# EAGLE design TEC-Controller (EAGLE 7.5.0)
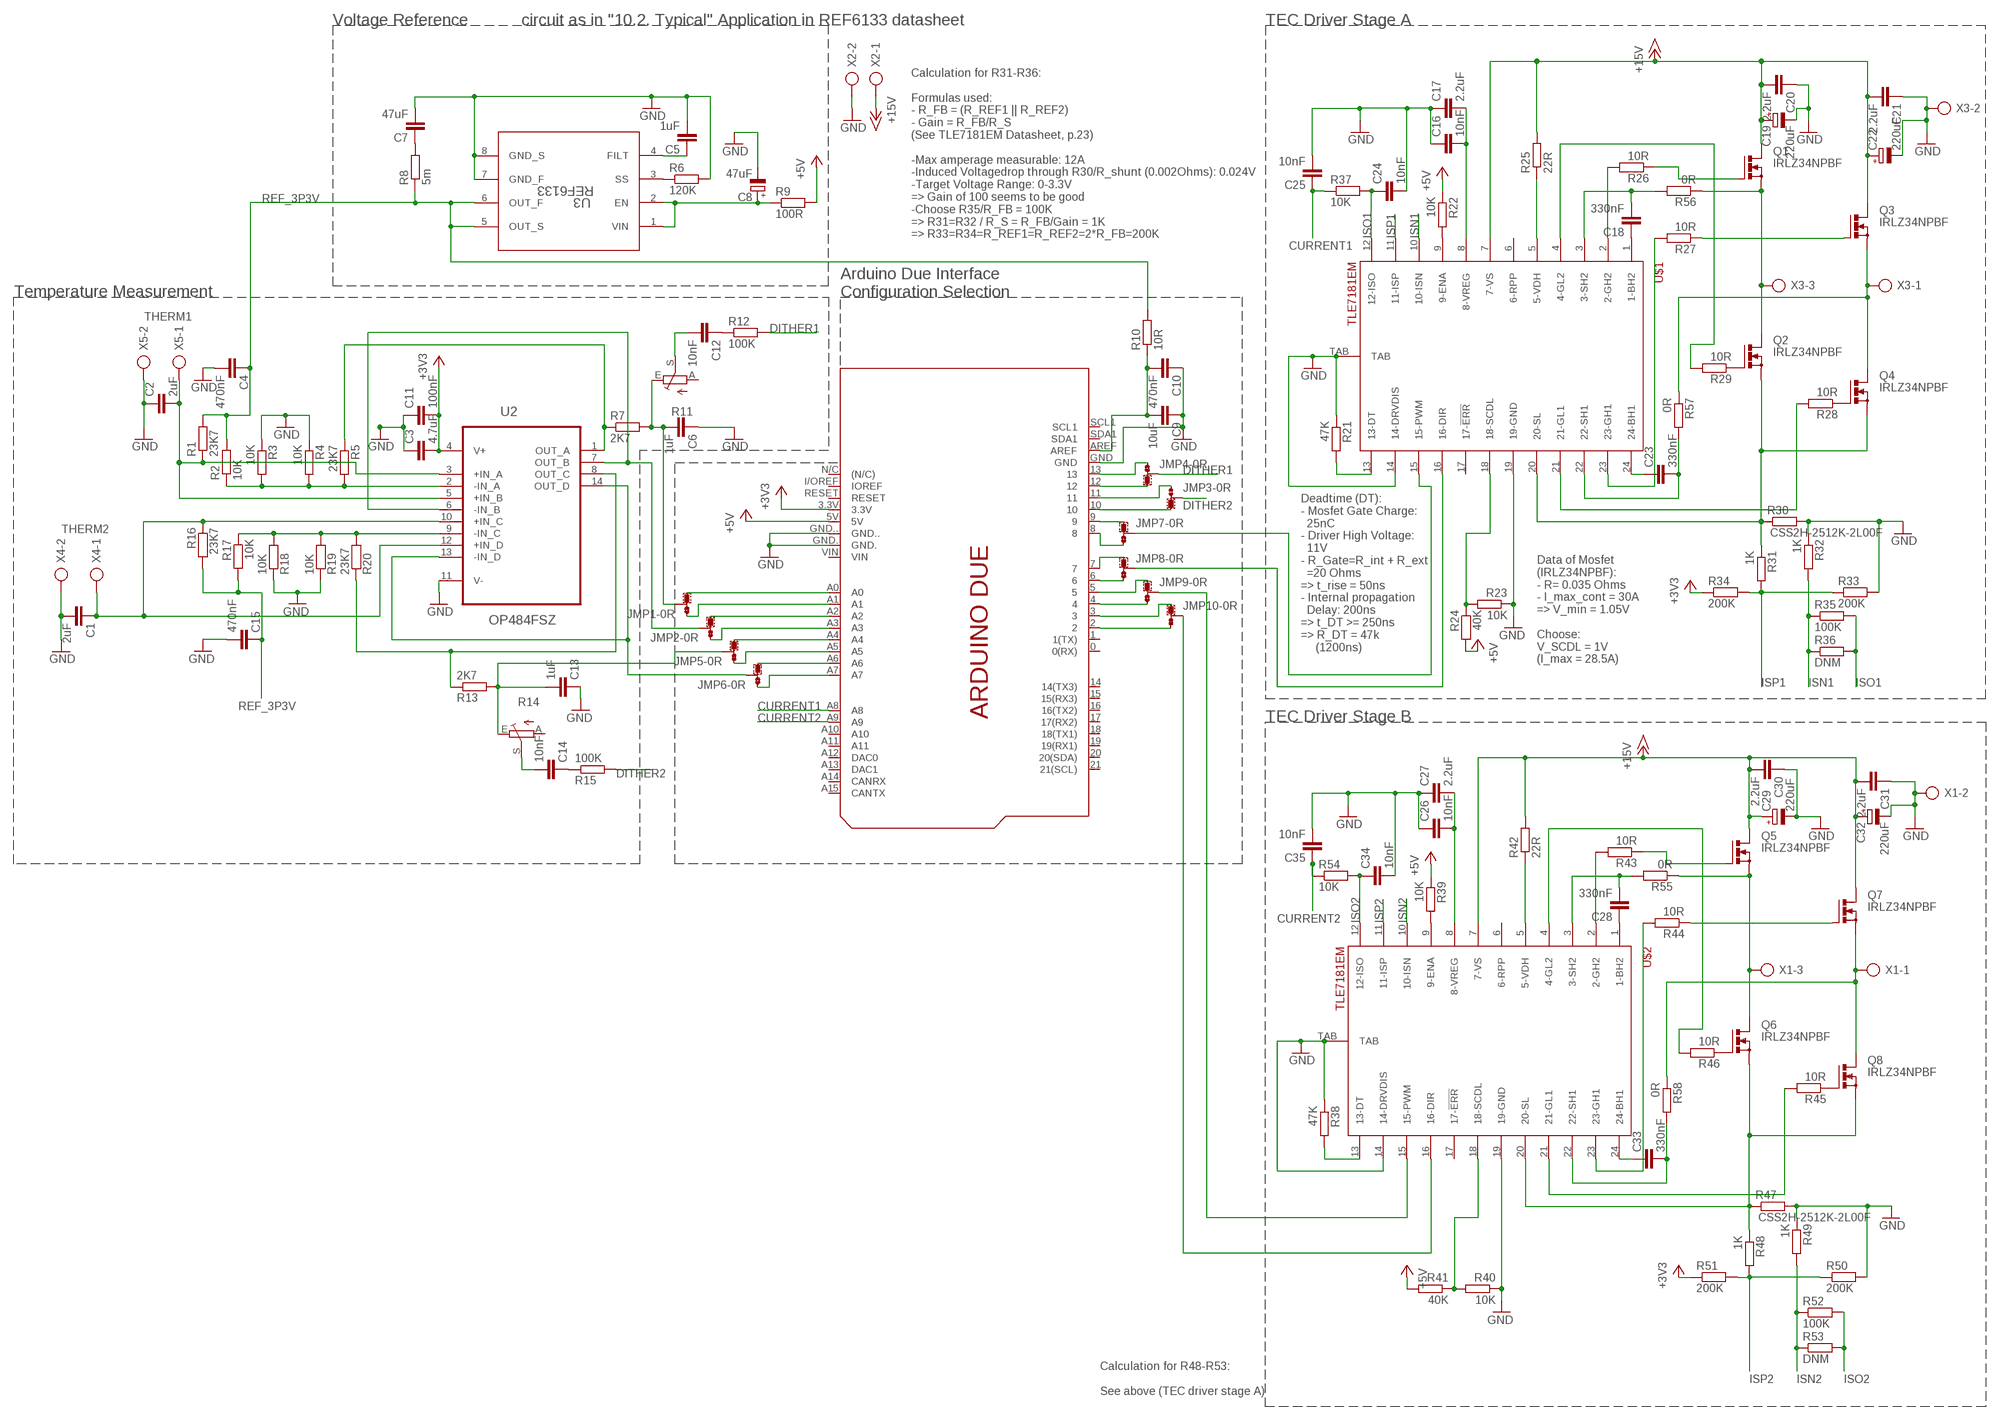
[diagram p0: schematic, sheet 1]

## Parts
C1  2uF  C-EUC0805  [C0805]
C2  2uF  C-EUC0805  [C0805]
C3  4.7uF  C-EUC0603  [C0603]
C4  470nF  C-EUC0805  [C0805]
C5  1uF  C-EUC0805  [C0805]
C6  1uF  C-EUC0805  [C0805]
C7  47uF  C-EUC0603  [C0603]
C8  47uF  CPOL-EUD  [PANASONIC_D]
C9  10uF  C-EUC0603  [C0603]
C10  470nF  C-EUC0603  [C0603]
C11  100nF  C-EUC0603  [C0603]
C12  10nF  C-EUC0805  [C0805]
C13  1uF  C-EUC0805  [C0805]
C14  10nF  C-EUC0805  [C0805]
C15  470nF  C-EUC0603  [C0603]
C16  10nF  C-EUC0603K  [C0603K]
C17  2.2uF  C-EUC0603K  [C0603K]
C18  330nF  C-EUC0603K  [C0603K]
C19  220uF  CPOL-EUE2.5-7  [E2,5-7]
C20  2.2uF  C-EUC0603K  [C0603K]
C21  2.2uF  C-EUC0603K  [C0603K]
C22  220uF  CPOL-EUE2.5-7  [E2,5-7]
C23  330nF  C-EUC0603K  [C0603K]
C24  10nF  C-EUC0603K  [C0603K]
C25  10nF  C-EUC0603K  [C0603K]
C26  10nF  C-EUC0603  [C0603]
C27  2.2uF  C-EUC0603  [C0603]
C28  330nF  C-EUC0603K  [C0603K]
C29  220uF  CPOL-EUE2.5-7  [E2,5-7]
C30  2.2uF  C-EUC0603K  [C0603K]
C31  2.2uF  C-EUC0603K  [C0603K]
C32  220uF  CPOL-EUE2.5-7  [E2,5-7]
C33  330nF  C-EUC0603K  [C0603K]
C34  10nF  C-EUC0603  [C0603]
C35  10nF  C-EUC0603  [C0603]
JMP1  0R-JUMPA  [A0R-JMP]
JMP2  0R-JUMPA  [A0R-JMP]
JMP3  0R-JUMPA  [A0R-JMP]
JMP4  0R-JUMPA  [A0R-JMP]
JMP5  0R-JUMPA  [A0R-JMP]
JMP6  0R-JUMPA  [A0R-JMP]
JMP7  0R-JUMPA  [A0R-JMP]
JMP8  0R-JUMPA  [A0R-JMP]
JMP9  0R-JUMPA  [A0R-JMP]
JMP10  0R-JUMPA  [A0R-JMP]
PCB1  ARDUINO_DUE_SHIELD  [ARDUINO_DUE_SHIELD]
Q1  IRLZ34NPBF  PMOSFET_NTO220BV  [TO220BV]
Q2  IRLZ34NPBF  PMOSFET_NTO220BV  [TO220BV]
Q3  IRLZ34NPBF  PMOSFET_NTO220BV  [TO220BV]
Q4  IRLZ34NPBF  PMOSFET_NTO220BV  [TO220BV]
Q5  IRLZ34NPBF  PMOSFET_NTO220BV  [TO220BV]
Q6  IRLZ34NPBF  PMOSFET_NTO220BV  [TO220BV]
Q7  IRLZ34NPBF  PMOSFET_NTO220BV  [TO220BV]
Q8  IRLZ34NPBF  PMOSFET_NTO220BV  [TO220BV]
R1  23K7  R-EU_R0603  [R0603]
R2  10K  R-EU_R0603  [R0603]
R3  10K  R-EU_R0603  [R0603]
R4  10K  R-EU_R0805  [R0805]
R5  23K7  R-EU_R0805  [R0805]
R6  120K  R-EU_R0805  [R0805]
R7  2K7  R-EU_R0805  [R0805]
R8  5m  R-EU_R0603  [R0603]
R9  100R  R-EU_R0805  [R0805]
R10  10R  R-EU_R0805  [R0805]
R11  TRIM_EU-B64W  [B64W]
R12  100K  R-EU_R0805  [R0805]
R13  2K7  R-EU_R0805  [R0805]
R14  TRIM_EU-B64W  [B64W]
R15  100K  R-EU_R0805  [R0805]
R16  23K7  R-EU_R0805  [R0805]
R17  10K  R-EU_R0805  [R0805]
R18  10K  R-EU_R0805  [R0805]
R19  10K  R-EU_R0805  [R0805]
R20  23K7  R-EU_R0805  [R0805]
R21  47K  R-EU_R0603  [R0603]
R22  10K  R-EU_R0603  [R0603]
R23  10K  R-EU_R0603  [R0603]
R24  40K  R-EU_R0603  [R0603]
R25  22R  R-EU_R0603  [R0603]
R26  10R  R-EU_R0805  [R0805]
R27  10R  R-EU_0204/7  [0204/7]
R28  10R  R-EU_0204/7  [0204/7]
R29  10R  R-EU_0204/7  [0204/7]
R30  CSS2H-2512K-2L00F  R-EU_R2512  [R2512]
R31  1K  R-EU_R0603  [R0603]
R32  1K  R-EU_R0603  [R0603]
R33  200K  R-EU_R0603  [R0603]
R34  200K  R-EU_R0603  [R0603]
R35  100K  R-EU_R0603  [R0603]
R36  DNM  R-EU_R0603  [R0603]
R37  10K  R-EU_R0603  [R0603]
R38  47K  R-EU_R0603  [R0603]
R39  10K  R-EU_R0603  [R0603]
R40  10K  R-EU_R0603  [R0603]
R41  40K  R-EU_R0603  [R0603]
R42  22R  R-EU_R0603  [R0603]
R43  10R  R-EU_0204/7  [0204/7]
R44  10R  R-EU_0204/7  [0204/7]
R45  10R  R-EU_0204/7  [0204/7]
R46  10R  R-EU_0204/7  [0204/7]
R47  CSS2H-2512K-2L00F  R-EU_R2512  [R2512]
R48  1K  R-EU_R0603  [R0603]
R49  1K  R-EU_R0603  [R0603]
R50  200K  R-EU_R0603  [R0603]
R51  200K  R-EU_R0603  [R0603]
R52  100K  R-EU_R0603  [R0603]
R53  DNM  R-EU_R0603  [R0603]
R54  10K  R-EU_R0603  [R0603]
R55  0R  R-EU_0204/7  [0204/7]
R56  0R  R-EU_0204/7  [0204/7]
R57  0R  R-EU_0204/7  [0204/7]
R58  0R  R-EU_0204/7  [0204/7]
U2  OP484FSZ  [SOIC127P600X175-14N]
U3  REF6133  REF6033IDGKR  [DGK0008A_N]
U$1  TLE7181EM  [PG-SSOP-24-4]
U$2  TLE7181EM  [PG-SSOP-24-4]
X1  AK500/3  [AK500/3]
X2  AK500/2  [AK500/2]
X3  AK500/3  [AK500/3]
X4  AK500/2  [AK500/2]
X5  AK500/2  [AK500/2]

## Nets
+3V3: C3.2 C11.2 PCB1.3.3V R34.1 R51.1 U2.4(V+)
+5V: PCB1.5V R9.2 R22.1 R24.2 R39.1 R41.2
+15V: C19.+ C20.2 C21.2 C22.+ C29.+ C30.2 C31.2 C32.+ Q1.D Q3.D Q5.D Q7.D R25.2 R42.2 U$1.7(7-VS) U$2.7(7-VS) X2.1
CURRENT1: C25.1 PCB1.A8 R37.1
CURRENT2: C35.1 PCB1.A9 R54.1
DITHER1: JMP4.2 R12.2
DITHER2: JMP3.2 R15.2
GND: C1.2 C2.1 C3.1 C4.2 C5.2 C6.1 C7.2 C8.- C9.1 C10.1 C11.1 C13.1 C15.2 C16.1 C17.1 C19.- C20.1 C21.1 C22.- C24.2 C25.2 C26.1 C27.1 C29.- C30.1 C31.1 C32.- C34.2 C35.2 PCB1.GND PCB1.GND. PCB1.GND.. R3.1 R4.1 R6.2 R18.1 R19.1 R21.1 R23.1 R30.2 R32.1 R33.2 R38.1 R40.1 R47.2 R49.1 R50.2 U2.11(V-) U3.7(GND_F) U3.8(GND_S) U$1.14(14-DRVDIS) U$1.19(19-GND) U$1.TAB U$2.14(14-DRVDIS) U$2.19(19-GND) U$2.TAB X1.2 X2.2 X3.2 X4.2 X5.2
ISN1: R32.2 R35.1 R36.1 U$1.10(10-ISN)
ISN2: R49.2 R52.1 R53.1 U$2.10(10-ISN)
ISO1: C24.1 R35.2 R36.2 R37.2 U$1.12(12-ISO)
ISO2: C34.1 R52.2 R53.2 R54.2 U$2.12(12-ISO)
ISP1: R31.2 R33.1 R34.2 U$1.11(11-ISP)
ISP2: R48.2 R50.1 R51.2 U$2.11(11-ISP)
N$1: C28.2 R55.2 U$2.3(3-SH2)
N$2: C2.2 R1.1 U2.3(+IN_A) U2.5(+IN_B) X5.1
N$3: C1.1 R16.1 U2.10(+IN_C) U2.12(+IN_D) X4.1
N$4: R2.1 R3.2 R4.2 R5.2 U2.2(-IN_A)
N$5: C18.2 R56.2 U$1.3(3-SH2)
N$6: JMP2.2 U2.6(-IN_B) U2.7(OUT_B)
N$7: R5.1 R7.1 U2.1(OUT_A)
N$8: JMP4.3 PCB1.12
N$9: JMP1.3 PCB1.A0
N$10: C5.1 U3.4(FILT)
N$11: R6.1 U3.3(SS)
N$12: JMP1.1 PCB1.A1
N$13: JMP2.3 PCB1.A2
N$14: C6.2 JMP1.2 R7.2 R11.E
N$15: JMP2.1 PCB1.A3
N$16: C7.1 R8.2
N$17: C8.+ R9.1 U3.1(VIN) U3.2(EN)
N$18: C9.2 C10.2 PCB1.AREF R10.1
N$19: C12.2 R11.S
N$20: JMP3.1 PCB1.11
N$21: JMP4.1 PCB1.13
N$22: JMP7.1 PCB1.9
N$23: JMP3.3 PCB1.10
N$24: C12.1 R12.1
N$25: R17.1 R18.2 R19.2 R20.2 U2.9(-IN_C)
N$26: R13.1 R20.1 U2.8(OUT_C)
N$27: C13.2 JMP5.2 R13.2 R14.E
N$28: C14.1 R15.1
N$29: C14.2 R14.S
N$30: JMP5.3 PCB1.A4
N$31: JMP5.1 PCB1.A5
N$32: JMP7.3 PCB1.8
N$33: JMP6.3 PCB1.A6
N$34: JMP6.1 PCB1.A7
N$35: JMP6.2 U2.13(-IN_D) U2.14(OUT_D)
N$36: JMP8.1 PCB1.7
N$37: JMP8.3 PCB1.6
N$38: JMP7.2 U$1.15(15-PWM)
N$39: JMP8.2 U$1.16(16-DIR)
N$40: R21.2 U$1.13(13-DT)
N$41: R23.2 R24.1 U$1.18(18-SCDL)
N$42: R22.2 U$1.9(9-ENA)
N$43: R25.1 U$1.5(5-VDH)
N$44: C16.2 C17.2 U$1.8(8-VREG)
N$45: R26.2 U$1.2(2-GH2)
N$46: Q1.G R26.1
N$47: Q1.S Q2.D R56.1 X3.3
N$48: C18.1 U$1.1(1-BH2)
N$49: R27.2 U$1.23(23-GH1)
N$50: Q3.G R27.1
N$51: Q3.S Q4.D R57.1 X3.1
N$52: C23.1 U$1.24(24-BH1)
N$53: Q4.G R28.1
N$54: Q2.G R29.1
N$55: R29.2 U$1.4(4-GL2)
N$56: R28.2 U$1.21(21-GL1)
N$57: Q2.S Q4.S R30.1 R31.1 U$1.20(20-SL)
N$58: JMP9.2 U$2.15(15-PWM)
N$59: C33.2 R58.2 U$2.22(22-SH1)
N$60: JMP10.2 U$2.16(16-DIR)
N$61: R38.2 U$2.13(13-DT)
N$62: R39.2 U$2.9(9-ENA)
N$63: R40.2 R41.1 U$2.18(18-SCDL)
N$64: C26.2 C27.2 U$2.8(8-VREG)
N$65: R42.1 U$2.5(5-VDH)
N$66: R43.2 U$2.2(2-GH2)
N$67: Q5.S Q6.D R55.1 X1.3
N$68: C28.1 U$2.1(1-BH2)
N$69: Q5.G R43.1
N$70: R44.2 U$2.23(23-GH1)
N$71: Q7.G R44.1
N$72: Q7.S Q8.D R58.1 X1.1
N$73: C33.1 U$2.24(24-BH1)
N$74: Q8.G R45.1
N$75: Q6.G R46.1
N$76: R46.2 U$2.4(4-GL2)
N$77: R45.2 U$2.21(21-GL1)
N$78: Q6.S Q8.S R47.1 R48.1 U$2.20(20-SL)
N$79: C23.2 R57.2 U$1.22(22-SH1)
N$80: JMP9.1 PCB1.5
N$81: JMP9.3 PCB1.4
N$82: JMP10.1 PCB1.3
N$83: JMP10.3 PCB1.2
REF_3P3V: C4.1 C15.1 R1.2 R2.2 R8.1 R10.2 R16.2 R17.2 U3.5(OUT_S) U3.6(OUT_F)
Unconnected: PCB1.0(0(RX)) PCB1.1(1(TX)) PCB1.14(14(TX3)) PCB1.15(15(RX3)) PCB1.16(16(TX2)) PCB1.17(17(RX2)) PCB1.18(18(TX1)) PCB1.19(19(RX1)) PCB1.20(20(SDA)) PCB1.21(21(SCL)) PCB1.A10 PCB1.A11 PCB1.A12(DAC0) PCB1.A13(DAC1) PCB1.A14(CANRX) PCB1.A15(CANTX) PCB1.I/OREF(IOREF) PCB1.N/C((N/C)) PCB1.RESET PCB1.SCL1 PCB1.SDA1 PCB1.VIN R11.A R14.A U$1.6(6-RPP) U$1.17(17-!ERR) U$2.6(6-RPP) U$2.17(17-!ERR)

## Notes on the sheet
- Voltage Reference | circuit as in "10.2. Typical" Application in REF6133 datasheet | TEC Driver Stage A
- Calculation for R31-R36:
  
  Formulas used:
  - R_FB = (R_REF1 || R_REF2)
  - Gain = R_FB/R_S
  (See TLE7181EM Datasheet, p.23)
  
  -Max amperage measurable: 12A
  -Induced Voltagedrop through R30/R_shunt (0.002Ohms): 0.024V
  -Target Voltage Range: 0-3.3V
  => Gain of 100 seems to be good
  -Choose R35/R_FB = 100K
  => R31=R32 / R_S = R_FB/Gain = 1K
  => R33=R34=R_REF1=R_REF2=2*R_FB=200K
- Temperature Measurement
- Arduino Due Interface 
  Configuration Selection
- THERM1
- THERM2
- Deadtime (DT):
  - Mosfet Gate Charge: 
    25nC
  - Driver High Voltage: 
    11V
  - R_Gate=R_int + R_ext 
    =20 Ohms
  => t_rise = 50ns
  - Internal propagation 
    Delay: 200ns
  => t_DT >= 250ns
  => R_DT = 47k 
       (1200ns)
- Data of Mosfet 
  (IRLZ34NPBF):
  - R= 0.035 Ohms
  - I_max_cont = 30A
  => V_min = 1.05V
  
  Choose:
  V_SCDL = 1V 
  (I_max = 28.5A)
- TEC Driver Stage B
- Calculation for R48-R53:
  
  See above (TEC driver stage A)

## Library data of the parts
C1-C7 C9-C18 C20 C21 C23-C28 C30 C31 C33-C35 = resistor:C-EU: CAPACITOR, European symbol
C8 C19 C22 C29 C32 = rcl:CPOL-EU: POLARIZED CAPACITOR, European symbol
JMP1-JMP10 = jump-0r-smd:0R-JUMP: SMD 0R 0805 Jumper
PCB1 = E14_Arduino_revC:ARDUINO_DUE_SHIELD: Device for representing an Arduino Due board with a footprint in an EAGLE design. Created by Dave Young for Element14. More EAGLE documentation at: http://www.element14.com/community/community/knode/cadsoft_eagle
Q1-Q8 = transistor-power:PMOSFET_N: Power MOSFET N-Channel
R1 R16 = rcl:R-EU_: RESISTOR, European symbol; ORIGINAL: 1-R8
R2-R10 R12 R13 R15 R17-R58 = rcl:R-EU_: RESISTOR, European symbol
R11 R14 = pot:TRIM_EU-: POTENTIOMETER
U2 = Analog Devices_By_element14_Batch_1:OP484FSZ: Precision Rail-to-Rail Input and Output Operational Amplifiers; MPN: OP484FSZ; OC_FARNELL: 1439000; OC_NEWARK: 59K8937; PACKAGE: SOIC-14; SUPPLIER: Analog Devices
U3 = TI-REF6033:REF6033IDGKR; MANUFACTURER: Texas Instruments; PARTNUMBER: REF6033IDGKR; REFDES: RefDes; TYPE: TYPE; VALUE: Value
U$1 U$2 = infineon-hbridge:TLE7181EM
X1 X3 = con-ptr500:AK500/3: CONNECTOR; OC_FARNELL: unknown; OC_NEWARK: unknown
X2 X4 X5 = con-ptr500:AK500/2: CONNECTOR; OC_FARNELL: unknown; OC_NEWARK: unknown

## Board
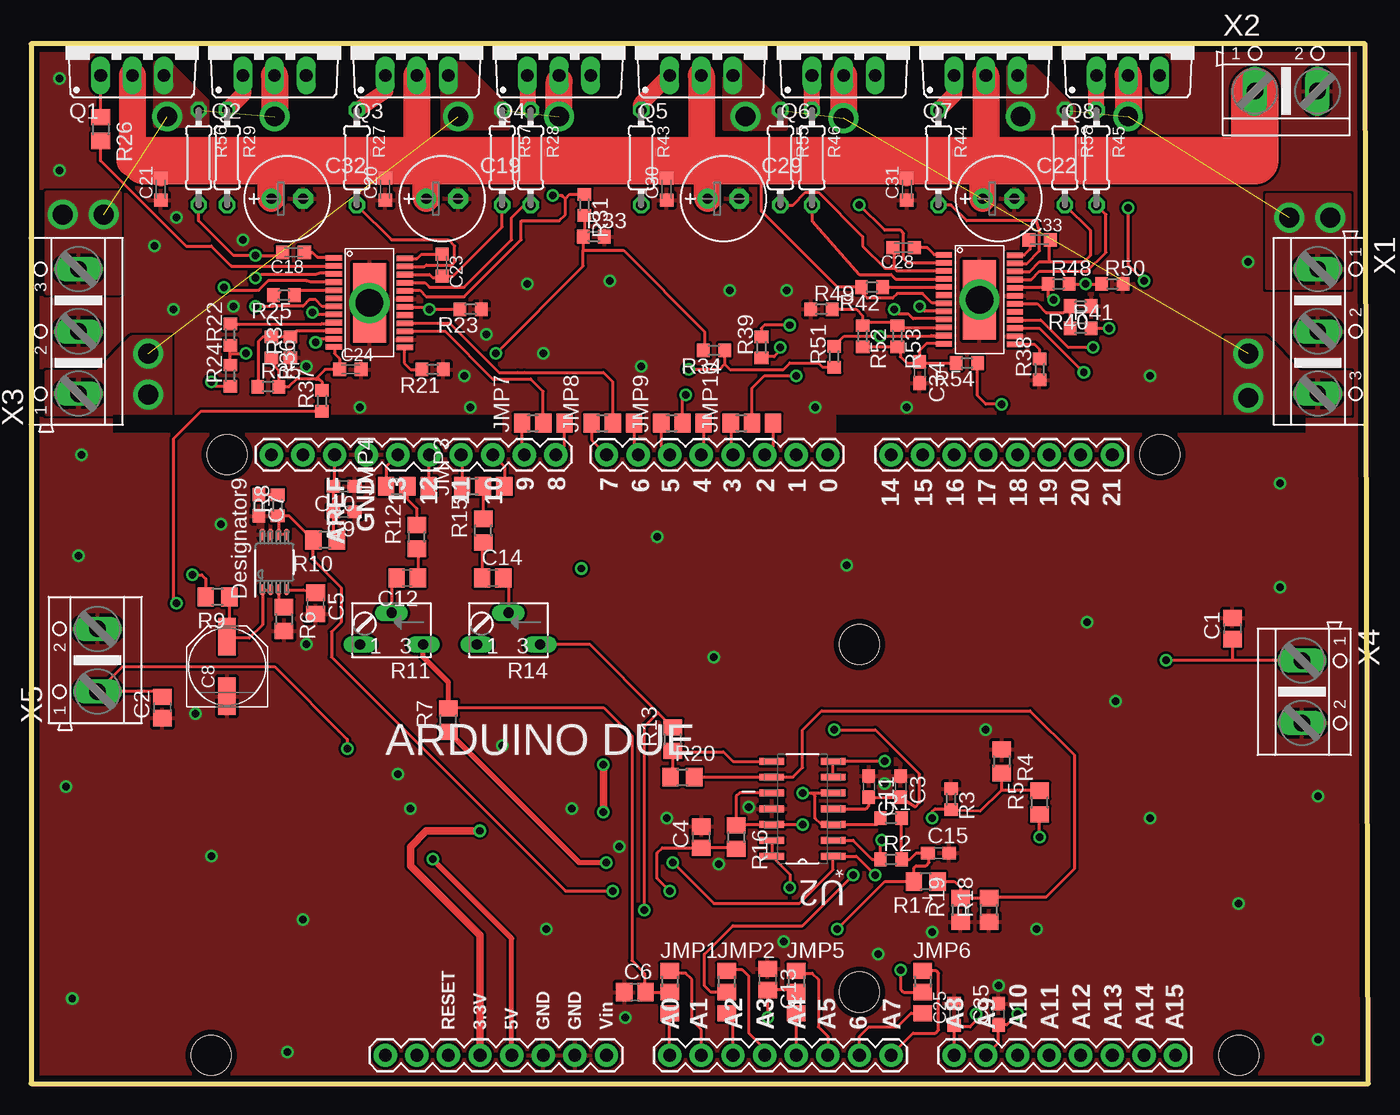
[diagram p1: board, top side]
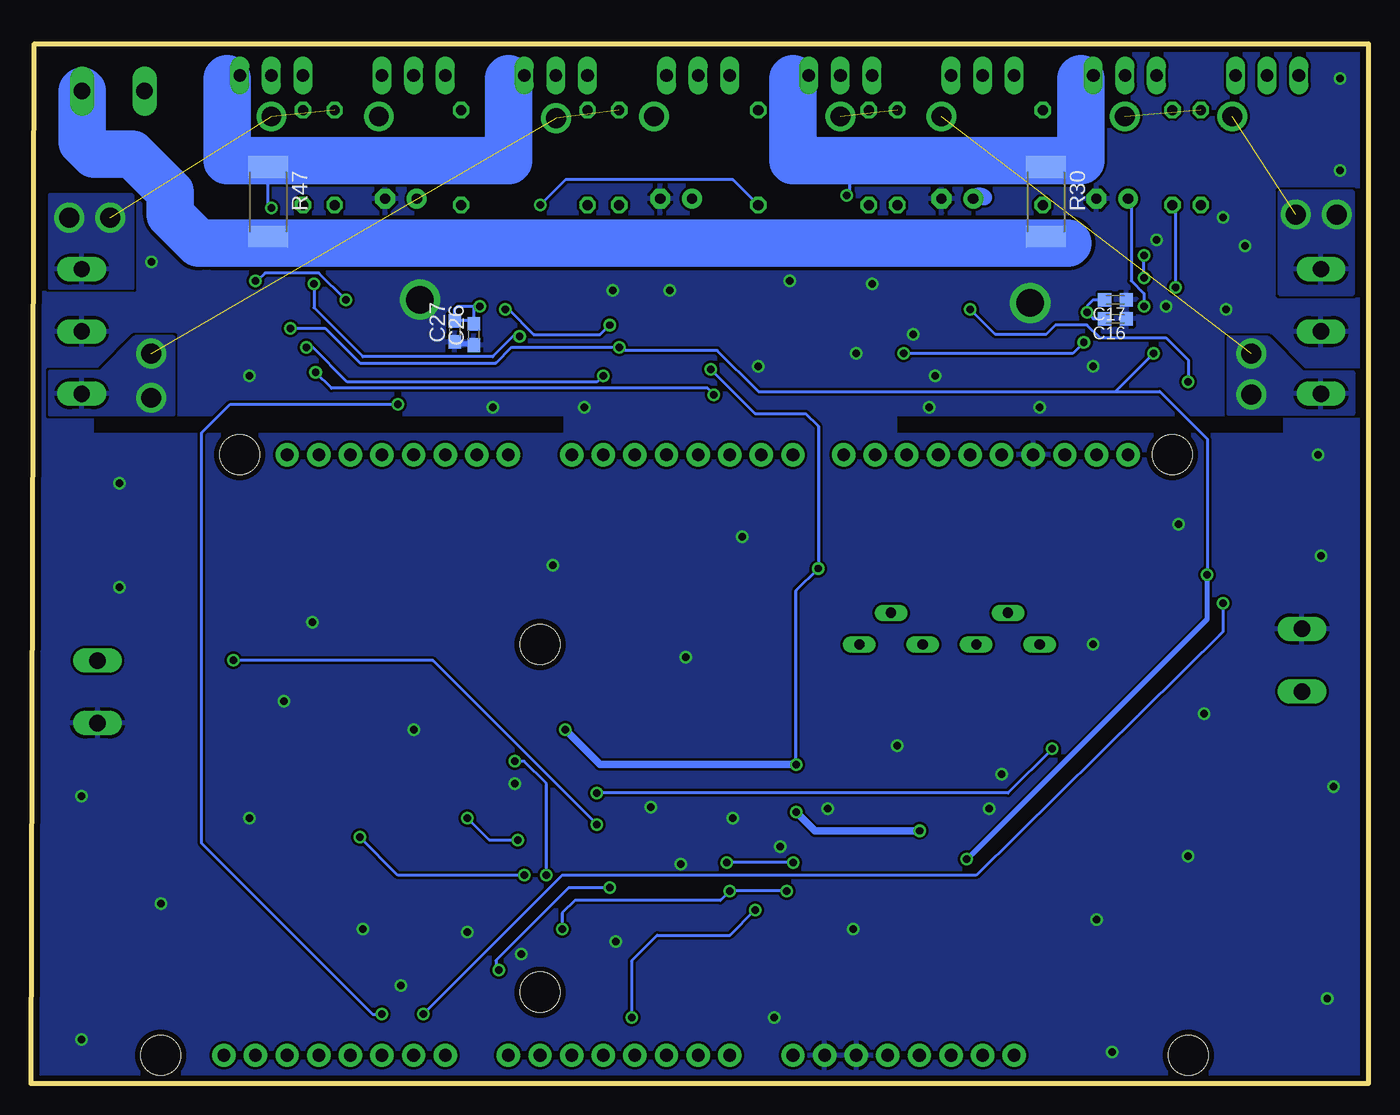
[diagram p2: board, bottom side, seen from below]

Size 107.44 x 83.57 mm. Coordinates in mm from the lower left corner, seen from the top.
Outline: 0,0 107.44,0 107.19,83.57 0,83.57 0,0
Copper layers (1*16): Top 0.07mm / dielectric 1.5mm / Bottom 0.07mm
Design rules "default *": minimum track width 0.2mm, minimum drill 0.6mm, track to track 0.2mm, track to pad 0.2mm, pad to pad 0.2mm, via to via 0.2mm, smd to smd 0.2mm, copper to edge 0.45mm, drill to drill 1mm, minimum pad ring 10mil, minimum via ring 8mil, stop-mask expansion 0.05mm, vias tented up to drill 0mil, thermal gap 10mil
tRestrict: area 6.6,52.3 to 37.8,53.7; area 64.7,52.3 to 102.4,53.7
bRestrict: area -1.8,88.1 to 113,119.6; area 6.9,52.3 to 37.8,53.6; area 64.7,52.3 to 102.4,53.6; 7 lines

### Footprints (pad centres in the part's own frame; a part is rotated, then mirrored left to right if it is on the bottom)
C0805 = smd 1.3 x 1.5: 1 -0.85,0; 2 0.85,0
C0603 = smd 1.1 x 1: 1 -0.85,0; 2 0.85,0
PANASONIC_D = smd 3 x 1.4: + 2.4,0; - -2.4,0
C0603K = smd 1.05 x 1.08: 1 -0.875,0; 2 0.875,0
E2,5-7 = drill 0.813 pad 1.6: + -1.27,0 | drill 0.813 pad 1.6 octagon: - 1.27,0
A0R-JMP = smd 1.5 x 1.3: 1 0,1.7; 2 0,0; 3 0,-1.7
ARDUINO_DUE_SHIELD = drill 1.016 pad 1.88: 0 49.53,48.26; 1 46.99,48.26; 2 44.45,48.26; 3 41.91,48.26; 3.3V 21.59,0; 4 39.37,48.26; 5 36.83,48.26; 5V 24.13,0; 6 34.29,48.26; 7 31.75,48.26; 8 27.686,48.26; 9 25.146,48.26; 10 22.606,48.26; 11 20.066,48.26; 12 17.526,48.26; 13 14.986,48.26; 14 54.61,48.26; 15 57.15,48.26; 16 59.69,48.26; 17 62.23,48.26; 18 64.77,48.26; 19 67.31,48.26; 20 69.85,48.26; 21 72.39,48.26; A0 36.83,0; A1 39.37,0; A2 41.91,0; A3 44.45,0; A4 46.99,0; A5 49.53,0; A6 52.07,0; A7 54.61,0; A8 59.69,0; A9 62.23,0; A10 64.77,0; A11 67.31,0; A12 69.85,0; A13 72.39,0; A14 74.93,0; A15 77.47,0; AREF 9.906,48.26; GND 12.446,48.26; GND. 29.21,0; GND.. 26.67,0; I/OREF 16.51,0; N/C 13.97,0; RESET 19.05,0; SCL1 4.826,48.26; SDA1 7.366,48.26; VIN 31.75,0 | hole 3.2: 1.27,48.26; 0,0; 52.07,33.02; 52.07,5.08; 76.2,48.26; 82.55,0
TO220BV = drill 1.016 long: D 0,-2.54; G -2.54,-2.54; S 2.54,-2.54
R0603 = smd 1 x 1.1: 1 -0.85,0; 2 0.85,0
R0805 = smd 1.3 x 1.5: 1 -0.95,0; 2 0.95,0
B64W = drill 0.813 long: A 2.54,0; E -2.54,0; S 0,-2.54
0204/7 = drill 0.813 octagon: 1 -3.81,0; 2 3.81,0
R2512 = smd 1.8 x 3.2: 1 -2.8,0; 2 2.8,0
SOIC127P600X175-14N = smd 1.981 x 0.559: 1 -2.464,3.81; 2 -2.464,2.54; 3 -2.464,1.27; 4 -2.464,0; 5 -2.464,-1.27; 6 -2.464,-2.54; 7 -2.464,-3.81; 8 2.464,-3.81; 9 2.464,-2.54; 10 2.464,-1.27; 11 2.464,0; 12 2.464,1.27; 13 2.464,2.54; 14 2.464,3.81
DGK0008A_N = smd 0.9 x 0.45: 1 -2.225,0.975; 2 -2.225,0.325; 3 -2.225,-0.325; 4 -2.225,-0.975; 5 2.225,-0.975; 6 2.225,-0.325; 7 2.225,0.325; 8 2.225,0.975
PG-SSOP-24-4 = smd 0.45 x 1.3: 1 -3.625,-2.85; 2 -2.975,-2.85; 3 -2.325,-2.85; 4 -1.675,-2.85; 5 -1.025,-2.85; 6 -0.375,-2.85; 7 0.275,-2.85; 8 0.925,-2.85; 9 1.575,-2.85; 10 2.225,-2.85; 11 2.875,-2.85; 12 3.525,-2.85; 13 3.575,2.85; 14 2.925,2.85; 15 2.275,2.85; 16 1.625,2.85; 17 0.975,2.85; 18 0.325,2.85; 19 -0.325,2.85; 20 -0.975,2.85; 21 -1.625,2.85; 22 -2.275,2.85; 23 -2.925,2.85; 24 -3.575,2.85 | smd 6.4 x 2.65: TAB 0,0
AK500/3 = drill 1.321 long: 1 -5.004,0; 2 0,0; 3 5.004,0
AK500/2 = drill 1.321 long: 1 -2.515,0; 2 2.515,0

### Placement (x,y rotation side)
C1  96.52,36.58 90 top
C2  10.54,30.23 90 top
C3  69.85,23.88 270 top
C4  53.85,19.81 90 top
C5  22.86,38.61 270 top
C6  48.51,7.37 0 top
C7  18.29,46.48 270 top
C8  15.75,33.53 90 top
C9  25.15,45.97 180 top
C10  25.15,48.01 180 top
C11  67.31,23.88 270 top
C12  30.23,40.64 180 top
C13  59.18,8.38 270 top
C14  37.08,40.64 0 top
C15  72.9,18.54 0 top
C16  20.32,61.47 180 bottom
C17  20.32,62.99 180 bottom
C18  21.08,66.8 180 top
C19  33.02,71.12 0 top
C20  28.45,71.88 90 top
C21  10.41,71.88 90 top
C22  77.72,71.12 0 top
C23  33.02,65.79 270 top
C24  25.65,57.4 0 top
C25  74.17,5.59 90 top
C26  71.88,60.2 90 bottom
C27  73.41,60.45 90 bottom
C28  70.1,67.18 180 top
C29  55.63,71.12 0 top
C30  51.05,71.88 90 top
C31  70.36,71.88 90 top
C32  20.57,71.12 0 top
C33  81.03,67.82 0 top
C34  71.37,57.15 270 top
C35  77.72,5.59 90 top
JMP1  51.31,7.37 0 top
JMP2  55.88,7.37 0 top
JMP3  36.32,48.01 90 top
JMP4  30.23,48.01 90 top
JMP5  61.47,7.37 0 top
JMP6  71.63,7.37 0 top
JMP7  41.15,53.09 90 top
JMP8  46.74,53.09 90 top
JMP9  52.32,53.09 90 top
JMP10  57.91,53.09 90 top
PCB1  14.48,2.29 0 top
Q1  8.13,83.57 0 top
Q2  19.56,83.57 0 top
Q3  30.99,83.57 0 top
Q4  42.42,83.57 0 top
Q5  53.85,83.57 0 top
Q6  65.28,83.57 0 top
Q7  76.71,83.57 0 top
Q8  88.14,83.57 0 top
R1  69.09,21.34 0 top
R2  69.09,18.03 0 top
R3  73.91,22.86 270 top
R4  77.98,25.91 270 top
R5  81.03,22.61 90 top
R6  20.32,37.34 270 top
R7  33.53,29.21 90 top
R8  19.81,46.48 90 top
R9  14.99,39.12 180 top
R10  23.62,43.69 180 top
R11  28.96,35.31 180 top
R12  30.99,43.94 90 top
R13  51.56,27.69 90 top
R14  38.35,35.31 180 top
R15  36.32,44.45 90 top
R16  56.64,19.81 270 top
R17  71.88,16.26 180 top
R18  76.96,13.97 90 top
R19  74.68,13.97 90 top
R20  52.32,24.64 0 top
R21  32.26,57.4 180 top
R22  16,60.2 90 top
R23  35.31,62.23 180 top
R24  16,56.9 90 top
R25  20.32,63.37 180 top
R26  5.59,76.71 270 top
R27  26.16,74.42 270 top
R28  40.13,74.42 270 top
R29  15.75,74.42 270 top
R30  25.91,70.87 270 bottom
R31  44.45,70.61 270 top
R32  20.83,59.18 90 top
R33  45.21,68.07 0 top
R34  54.86,58.93 180 top
R35  19.05,56.01 0 top
R36  19.3,59.18 270 top
R37  23.37,54.86 90 top
R38  81.03,57.4 90 top
R39  58.67,59.18 90 top
R40  84.33,62.48 180 top
R41  84.33,60.71 0 top
R42  67.56,64.01 180 top
R43  49.02,74.42 270 top
R44  72.9,74.42 270 top
R45  85.6,74.42 270 top
R46  62.74,74.42 270 top
R47  88.39,70.87 270 bottom
R48  82.55,64.26 0 top
R49  63.5,62.23 0 top
R50  86.87,64.26 0 top
R51  64.52,58.42 90 top
R52  66.8,60.07 270 top
R53  69.6,60.07 270 top
R54  75.18,57.91 180 top
R55  60.2,74.42 270 top
R56  13.46,74.42 270 top
R57  37.85,74.42 270 top
R58  83.06,74.42 270 top
U2  61.98,22.1 180 top
U3  19.56,41.91 90 top
U$1  27.18,62.74 270 top
U$2  76.2,62.99 270 top
X1  103.38,60.45 270 top
X2  100.84,79.76 0 top
X3  3.81,60.45 90 top
X4  102.11,31.5 270 top
X5  5.33,34.04 90 top

### Tracks (layer width: path | path; a pad name or v marks a point on that pad's centre or on a via)
+3V3  (via drill 0.6)
  Top 0.254: R34.1 55.71,57.82 | 55.71,57.82 56.13,57.4 60.45,57.4 60.96,57.91 63.25,57.91 63.59,57.57 R51.1 | 55.71,57.82 55.29,57.4 v52.83,57.4 | v64.52,28.45 67.82,28.45 71.37,24.89 71.37,22.61 71.03,22.26 C3.2 C11.2 67.31,22.35 67.06,22.1 U2.4
  Top 0.61: PCB1.3.3V 36.07,11.94 30.48,17.53 30.48,19.05 31.75,20.32 v36.07,20.32 | v45.97,21.84 v45.97,25.65
  Bottom 0.254: v52.83,57.4 49.28,53.85 45.21,53.85 44.2,52.83 v44.2,41.4 45.97,39.62 v45.97,25.65
  Bottom 0.61: v36.07,20.32 44.45,20.32 v45.97,21.84 | v45.97,25.65 61.72,25.65 v64.52,28.45
+5V  (via drill 0.6)
  Top 0.254: R41.2 v86.61,60.71 | v60.2,59.18 60.2,58.93 59.69,58.42 59.02,58.42 R39.1 | R24.2 16,58.67 | 16,58.67 R22.1 | 16,58.67 v17.27,58.67 | v12.95,40.89 13.72,40.89 14.04,40.57 R9.2
  Top 0.406: PCB1.5V 38.61,11.68 v32.26,18.03
  Bottom 0.254: v86.61,60.71 83.82,60.71 81.03,57.91 70.1,57.91 68.83,59.18 v60.2,59.18 59.94,58.93 52.32,58.93 49.02,55.63 20.32,55.63 | 20.32,55.63 v17.27,58.67 | 20.32,55.63 16.76,55.63 12.95,51.82 v12.95,40.89
  Bottom 0.406: v32.26,18.03 12.95,37.34 v12.95,40.89
+15V  (via drill 0.6)
  Top 0.254: U$2.7 73.33,62.74 72.39,62.74 71.63,63.5 69.6,63.5 69.22,63.12 67.18,63.12 66.71,63.59 R42.2 64.77,64.01 58.67,70.1 58.67,73.66 58.93,73.91 58.93,74.17 | U$1.7 23.39,62.46 22.86,62.99 22.35,62.99 21.84,62.48 19.47,62.48 | 19.98,63.59 R25.2 19.47,62.48 | C30.2 52.46,74.17 53.09,74.17 | v18.03,62.48 19.47,62.48 | C20.2 29.32,72.76 30.73,74.17
  Top 1.27: 98.3,74.17 98.32,74.68 | C29.+ 54.61,70.87 | C31.2 71.41,73.81 76.51,73.81 | C21.2 10.41,73.15 arc90 9.4,74.17
  Top 2.184: Q5.D 53.85,75.44 54.36,74.17 | Q7.D 76.71,74.42 | 76.71,74.42 88.14,74.17 | Q1.D 8.13,74.17 | C22.+ 76.45,73.66 76.51,73.81 76.71,74.42 | C29.+ 54.36,73.91 54.1,74.17 | C19.+ 31.75,74.17 | C32.+ 19.3,74.17 | Q3.D 30.99,74.17
  Top 2.54: 9.14,74.17 8.13,74.17
  Top 3.81: 9.14,74.17 9.4,74.17 19.3,74.17 30.73,74.17 30.99,74.17 31.75,74.17 53.09,74.17 54.1,74.17 54.36,74.17 58.93,74.17 88.14,74.17 98.3,74.17 | 98.32,74.68 X2.1
  Bottom 0.254: C32.+ 19.56,71.12 19.05,70.61 19.05,64.52 18.03,63.5 v18.03,62.48
  Bottom 1.27: 30.88,71.23 arc-90 C19.+
CURRENT1  (via drill 0.6)
  Top 0.254: PCB1.A8 C25.1 74.31,4.57 75.44,4.57 75.95,5.08 v75.95,5.59 | R37.1 13.63,54.01 11.43,51.82 11.43,38.86 v11.68,38.61
  Bottom 0.254: v11.68,38.61 11.68,36.32 31.5,16.76 64.77,16.76 v75.95,5.59
CURRENT2  (via drill 0.6)
  Top 0.254: v77.98,54.61 76.71,54.61 76.03,55.28 R54.1 | v79.25,5.59 78.4,4.74 C35.1 77.72,3.3 PCB1.A9
  Bottom 0.254: v77.98,54.61 91.44,54.61 93.73,52.32 93.73,19.3 80.01,5.59 v79.25,5.59
DITHER1
  Top 0.254: JMP4.2 30.23,46.99 30.99,46.23 R12.2
DITHER2
  Top 0.254: JMP3.2 R15.2
GND  (via drill 0.6, 2.2 pad 2.54)
  Bottom 0.254: 24.13,67.56 R30.2 | R47.2 88.39,67.56
  Bottom 0.406: C26.1 71.97,59.44 73.41,59.44
  Bottom 3.81: 24.13,67.56 88.39,67.56 93.98,67.56 96.27,69.85 96.27,71.63 99.31,74.68 102.36,74.68 103.35,75.67 X2.2
  other vias: 11.68,69.6 22.1,57.66 34.8,56.9 36.58,60.2 46.48,64.52 49.02,57.66 60.71,63.75 62.99,54.36 17.02,67.82 16.26,62.48 68.58,24.13 76.71,28.45 103.38,23.11 103.38,3.56 97.03,14.48 80.77,12.45 89.92,21.34 87.12,30.73 84.84,37.08 100.33,48.26 100.33,39.88 65.53,41.66 54.86,34.29 50.29,43.94 56.13,63.75 97.79,66.04 89.92,56.9 41.15,58.67 39.88,64.26 9.91,67.31 11.43,62.23 26.42,54.36 35.31,54.36 70.36,54.36 4.06,50.55 3.81,42.42 2.79,23.88 3.3,6.86 20.57,2.54 14.48,18.29 21.84,13.21 37.85,27.18 43.43,22.1 47.24,19.05 51.05,21.34 55.24,17.65 47.75,5.33 41.4,12.45 15.24,44.96 2.29,80.77 2.29,73.41 13.21,29.72 22.1,35.31 60.45,11.43 68.07,10.41 72.39,12.19 77.72,7.87 27.18,62.74 76.2,62.99 57.66,22.22 29.46,24.89 30.48,22.1
  pour Top (rank 2): 0,-0.25 0,83.57 107.19,83.57 107.19,-0.25
  pour Bottom (rank 2): 0,0 107.19,-0.25 107.19,83.31 0,83.57
ISN1
  Top 0.254: R35.1 18.29,56.3 18.29,59.69 18.63,60.03 R36.1 R32.2 21.31,60.51 U$1.10
ISN2
  Top 0.254: U$2.10 69.75,60.77 R53.1 69.3,61.21 67.06,61.21 66.86,61.02 66.83,61.02 R52.1 66.8,61.72 66.29,62.23 R49.2
ISO1
  Top 0.254: 19.3,58.42 R36.2 19.56,58.08 19.56,57.66 19.9,57.32 R35.2 20.7,56.01 21.34,56.64 22.86,56.64 | U$1.12 24.3,59.18 24.38,59.09 24.38,58.67 24.78,58.28 C24.1 23.62,57.4 22.86,56.64 | 23.03,55.63 R37.2 23.37,56.39 23.11,56.64 22.86,56.64
ISO2
  Top 0.254: R52.2 R53.2 arc-90 69.84,59.47 69.84,58.43 70.36,57.91 71.29,57.91 C34.1 | U$2.12 71.91,59.47 71.37,58.93 C34.1 | C34.1 71.37,57.91 R54.2
ISP1  (via drill 0.6)
  Top 0.254: U$1.11 24.28,59.82 22.99,59.82 22.86,59.69 v22.86,59.56 | R31.2 44.45,68.16 R33.1 44.36,66.97 | 44.36,66.97 47.59,66.97 54.1,60.45 54.1,59.02 R34.2 | v37.34,58.67 44.36,65.7 44.36,66.97
  Bottom 0.254: v22.86,59.56 23.75,58.67 v37.34,58.67
ISP2  (via drill 0.6)
  Top 0.254: R51.2 65.32,60.07 v68.2,60.07 | v68.2,60.07 72.26,60.07 72.31,60.12 U$2.11 73.3,60.07 v68.2,60.07 | R48.2 v84.71,64.26 R50.1
  Bottom 0.254: v84.71,64.26 84.71,62.36 80.77,58.42 70.36,58.42 68.71,60.07 v68.2,60.07
N$1
  Top 0.254: R55.2 61.21,70.61 62.23,71.63 63.25,71.63 66.8,68.07 66.8,67.31 68.58,65.53 69.34,65.53 | 72.61,65.32 U$2.3 69.56,65.32 69.34,65.53 | C28.2 69.34,67.18 69.34,65.53
N$2  (via drill 0.6)
  Top 0.254: v61.98,23.37 62.74,23.37 | 62.74,23.37 U2.5 | 62.74,23.37 62.99,23.11 62.99,21.34 63.5,20.83 U2.3 67.98,20.83 R1.1 | C2.2 11.11,31.52 X5.1 7.34,33.53 19.56,33.53 25.4,27.69 v25.4,26.92
  Bottom 0.254: v25.4,26.92 28.96,23.37 v61.98,23.37
N$3  (via drill 0.6)
  Top 0.254: v61.98,20.83 U2.12 56.71,20.83 R16.1 56.64,23.11 56.9,23.37 U2.10 | v91.19,34.04 96.52,34.04 | 96.52,34.04 102.08,34.04 X4.1 | C1.1 96.52,34.04
  Bottom 0.254: v61.98,20.83 75.16,34.01 91.16,34.01 v91.19,34.04
N$4  (via drill 0.6)
  Top 0.254: 73.98,21.84 R3.2 | R3.2 76.27,21.91 77.98,23.62 | 77.98,23.62 R4.2 77.98,25.08 | 77.98,23.62 80.96,23.62 R5.2 | U2.2 66.04,19.56 67.56,18.03 R2.1 68.24,19.47 v68.33,19.56 | v72.39,21.34 72.39,21.84 72.64,22.1 73.83,22.1 R3.2
  Bottom 0.254: v68.33,19.56 70.61,19.56 v72.39,21.34
N$5  (via drill 0.6)
  Top 0.254: 20.46,66.55 C18.2 19.95,66.55 v18.03,66.55 16.26,66.55 13.46,69.34 R56.2 | U$1.3 24.24,65.15 23.24,65.15 22.86,65.02 18.54,65.02 v18.03,64.77
  Bottom 0.254: v18.03,64.77 v18.03,66.55
N$6  (via drill 0.6)
  Top 0.254: JMP2.2 54.61,7.37 54.1,7.87 54.1,10.41 56.39,12.7 61.98,12.7 v66.04,16.76 | v68.58,25.91 U2.7 U2.6
  Bottom 0.254: v66.04,16.76 66.04,24.13 67.82,25.91 v68.58,25.91
N$7  (via drill 0.6)
  Top 0.254: v51.56,17.78 54.86,14.48 61.72,14.48 64.44,17.2 U2.1 66.29,18.29 v67.82,16.76 | v81.03,19.81 R5.1
  Top 0.406: R7.1 44.01,17.78 v46.23,17.78
  Bottom 0.254: v46.23,17.78 v51.56,17.78 | v67.82,16.76 77.98,16.76 v81.03,19.81
N$8
  Top 0.254: PCB1.12 31.93,50.47 JMP4.3
N$9
  Top 0.254: PCB1.A0 JMP1.3
N$10
  Top 0.254: 22.32,39.12 22.38,39.18 C5.1 21.87,39.69 U3.4
N$11
  Top 0.254: U3.3 19.88,38.61 R6.1
N$12
  Top 0.254: PCB1.A1 53.85,4.32 53.09,5.08 53.09,8.38 52.58,8.89 51.48,8.89 JMP1.1
N$13
  Top 0.254: PCB1.A2 56.39,5.16 JMP2.3
N$14
  Top 0.254: JMP1.2 C6.2 49.28,7.45 49.28,8.89 48.26,9.91 48.26,27.94 45.97,30.23 33.59,30.23 R7.2
  Top 0.406: R7.2 33.53,32.26 31.5,34.29 R11.E
N$15
  Top 0.254: PCB1.A3 58.93,2.79 57.66,4.06 57.66,8.64 57.15,9.14 55.96,9.14 JMP2.1
N$16
  Top 0.254: C7.1 R8.2
N$17
  Top 0.254: R9.1 16,39.18 16.31,38.86 | U3.2 U3.1 18.58,36.87 17.53,35.81 15.86,35.81 C8.+ 15.94,36.25 R9.1 | 16,39.12 R9.1
N$18
  Top 0.254: PCB1.AREF 24.38,47.75 C10.2 C9.2 24.3,43.96 R10.1
N$19
  Top 0.254: C12.2 28.96,40.22 R11.S
N$20
  Top 0.254: PCB1.11 34.62,50.47 JMP3.1
N$21
  Top 0.254: PCB1.13 28.53,49.61 JMP4.1
N$22
  Top 0.254: PCB1.9 39.45,50.72 JMP7.1
N$23
  Top 0.254: PCB1.10 38.02,49.61 JMP3.3
N$24
  Top 0.254: R12.1 31.08,42.9 C12.1
N$25
  Top 0.254: R20.2 U2.9 61.21,24.64 61.98,25.4 61.98,28.45 63.5,29.97 80.26,29.97 83.82,26.42 83.82,17.27 81.53,14.99 77.03,14.99 R18.2 R19.2 74.68,15.81 74.17,16.26 R17.1
N$26
  Top 0.254: R20.1 51.56,24.83 R13.1 51.63,26.67 55.63,26.67 56.39,25.91 U2.8
N$27  (via drill 0.6)
  Top 0.254: 50.39,29.81 R13.2 51.58,28.61 | 50.39,29.81 44.89,35.31 R14.E | JMP5.2 61.3,7.53 C13.2 v59.18,5.33 | v49.28,13.97 49.28,28.7 50.39,29.81
  Bottom 0.254: v59.18,5.33 59.18,9.91 57.15,11.94 51.31,11.94 v49.28,13.97
N$28
  Top 0.254: R15.1 36.23,43.41 C14.1
N$29
  Top 0.254: C14.2 38.35,40.22 R14.S
N$30
  Top 0.254: JMP5.3 PCB1.A4
N$31
  Top 0.254: JMP5.1 61.64,8.89 62.74,8.89 63.25,8.38 63.25,4.57 64.01,3.81 PCB1.A5
N$32
  Top 0.254: PCB1.8 42.85,51.23 JMP7.3
N$33
  Top 0.254: PCB1.A6 66.55,3.81 67.31,4.57 69.6,4.57 70.69,5.67 JMP6.3
N$34
  Top 0.254: PCB1.A7 70.87,4.06 72.64,4.06 72.9,4.32 72.9,8.89 72.72,9.07 JMP6.1
N$35  (via drill 0.6)
  Top 0.254: U2.13 U2.14 | U2.14 59.44,18.21 | U2.14 60.96,16.84 v60.96,15.75 | v69.85,9.14 69.85,7.62 70.1,7.37 JMP6.2
  Bottom 0.254: v60.96,15.75 64.26,15.75 70.1,9.91 70.1,9.4 v69.85,9.14
N$36
  Top 0.254: JMP8.1 45.04,51.74 PCB1.7
N$37
  Top 0.254: JMP8.3 48.44,50.88 PCB1.6
N$38
  Top 0.254: U$1.15 33.26,60.46 37.08,56.64 40.13,56.64 41.15,55.63 JMP7.2
N$39
  Top 0.254: U$1.16 33.63,61.11 37.59,57.15 39.12,57.15 39.62,57.15 45.97,57.15 46.74,56.39 JMP8.2
N$40
  Top 0.254: U$1.13 29.97,59.11 29.97,57.91 30.48,57.4 R21.2
N$41  (via drill 0.6)
  Top 0.254: U$1.18 31.82,62.41 v32,62.23 R23.2 | v14.48,56.39 14.82,56.05 R24.1
  Bottom 0.254: v14.48,56.39 14.48,58.17 16.26,59.94 21.59,59.94 22.61,60.96 25.15,60.96 25.91,60.2 29.97,60.2 v32,62.23
N$42
  Top 0.254: R22.2 23.33,61.05 23.37,61.09 24.25,61.09 U$1.9
N$43
  Top 0.254: 24.32,63.75 U$1.5 21.69,63.76 R25.1
N$44  (via drill 0.6)
  Top 0.254: U$1.8 23.02,61.81 v22.61,61.98
  Bottom 0.254: C17.2 22.1,62.99 22.61,62.48 v22.61,61.98 22.1,61.47 C16.2
N$45
  Top 0.254: 23.89,65.79 U$1.2 16.07,65.71 14.48,67.31 12.45,67.31 5.59,74.17 R26.2
N$46
  Top 0.254: R26.1 Q1.G
N$47  (via drill 1.6)  (2 unrouted)
  Top 2.184: Q2.D v19.56,77.72
  other vias: 2.54,69.85 5.84,69.85 10.92,77.72
  pour Top: 1.27,63.5 1.27,71.63 7.11,71.63 7.11,63.5
  pour Top (no thermals): 9.91,82.04 9.91,76.96 14.22,76.96 14.22,78.99 11.18,82.04
  pour Bottom: 1.27,71.63 7.11,71.63 7.11,63.5 1.27,63.5
N$48
  Top 0.254: 24.13,66.29 24.33,66.35 U$1.1 24.27,66.42 22.99,66.42 22.61,66.8 C18.1
N$49
  Top 0.254: U$1.23 31.62,65.66 31.74,65.79 33.78,65.79 34.04,66.04 34.04,67.31 33.53,67.82 28.96,67.82 R27.2
N$50
  Top 1.27: R27.1 28.45,79.76 Q3.G
N$51  (via drill 1.6)  (2 unrouted)
  Top 0.254: 42.42,80.52 42.16,81.03 Q4.D
  Top 2.184: v42.42,77.72 42.42,80.52
  other vias: 9.4,58.67 9.4,55.37 34.29,77.72
  pour Top (no thermals): 33.02,82.04 34.8,82.04 38.35,78.49 38.35,76.71 33.02,76.71
  pour Bottom: 1.27,57.15 1.27,53.85 11.18,53.85 11.18,59.94 8.13,59.94 5.33,57.15
  pour Top: 1.27,56.39 1.27,53.85 11.18,53.85 11.18,59.94 8.13,59.94 5.33,57.15 1.27,57.15
N$52
  Top 0.254: U$1.24 31.01,66.31 31.36,66.66 C23.1
N$53
  Top 1.27: Q4.G 39.88,78.49 R28.1
N$54
  Top 1.27: Q2.G 17.02,79.5 R29.1
N$55  (via drill 0.6)
  Top 0.254: U$1.4 22.45,64.41 22.1,64.52 19.05,64.52 18.29,63.75 15.75,63.75 v15.49,64.01
  Bottom 0.254: R29.2 15.49,70.36 v15.49,64.01
N$56
  Top 0.254: U$1.21 31.65,64.36 32,64.01 34.8,64.01 38.61,67.82 38.61,69.6 39.88,70.87 R28.2
N$57  (via drill 0.6)
  Top 0.254: U$1.20 30.07,63.75 31.24,63.75 31.75,63.25 34.8,63.25 39.37,67.82 39.37,69.34 42.42,69.34 42.93,69.85 42.93,71.12 | 42.93,71.12 43.27,71.46 R31.1 | 42.93,71.12 42.67,71.37 v41.91,71.37
  Bottom 0.254: Q2.S 23.11,80.77 | 46.23,80.77 44.96,80.77 Q4.S | 46.23,74.17 44.45,74.17 44.2,73.91 44.2,75.69 | v41.91,71.37 41.66,71.63 41.66,74.17
  Bottom 1.27: 23.11,74.17 23.62,73.67 R30.1
  Bottom 3.81: 23.11,80.77 23.11,74.17 41.66,74.17 46.23,74.17 46.23,80.77
N$58  (via drill 0.6)
  Top 0.254: U$2.15 81.02,60.72 v84.58,57.15 | JMP9.2 52.32,55.12 v52.58,55.37
  Bottom 0.254: v52.58,55.37 53.09,55.88 83.31,55.88 v84.58,57.15
N$59
  Top 0.254: R58.2 85.09,68.58 85.09,66.55 84.58,66.04 81.79,66.04 | U$2.22 80.25,65.27 81.03,66.04 81.79,66.04 | C33.2 81.79,67.7 81.79,66.04
N$60  (via drill 0.6)
  Top 0.254: U$2.16 81.13,61.37 83.31,59.18 v85.34,59.18 | JMP10.2 57.91,55.88 58.93,56.9 v61.47,56.9
  Bottom 0.254: v85.34,59.18 84.84,59.18 82.04,56.39 61.98,56.39 v61.47,56.9
N$61
  Top 0.254: U$2.13 80.62,59.42 81.03,59.02 R38.2
N$62  (via drill 0.6)
  Top 0.254: U$2.9 73.3,61.47 70.87,61.47 70.48,61.85 69.72,61.85 v69.34,62.23 | v60.96,60.96 58.93,60.96 58.67,60.71 R39.2
  Bottom 0.254: v69.34,62.23 69.09,62.23 67.06,60.2 61.72,60.2 v60.96,60.96
N$63
  Top 0.254: 83.3,62.67 R40.2 | U$2.18 80.84,62.67 81.53,61.98 82.97,61.98 R40.2 | R41.1 R40.2
N$64  (via drill 0.6)
  Top 0.254: U$2.8 71.79,62.07 v71.37,62.48
  Bottom 0.254: 71.88,62.48 73.15,62.48 73.41,62.23 C27.2 72.14,61.3 C26.2 | v71.37,62.48 71.88,62.48 | 71.88,62.48 71.88,61.21
N$65
  Top 0.254: R42.1 U$2.5
N$66  (via drill 0.6)
  Top 0.254: 73.28,66.04 U$2.2 | v66.55,70.61 68.58,68.58 69.85,68.58 70.1,68.33 70.1,66.29 70.43,65.97 U$2.2 | 73.35,66.04 U$2.2
  Bottom 0.254: R43.2 51.05,72.64 64.52,72.64 v66.55,70.61
N$67  (via drill 1.6)  (2 unrouted)
  Top 2.184: Q6.D v65.28,77.6
  other vias: 97.79,55.12 97.79,58.67 57.4,77.72
  pour Top (no thermals): 55.63,80.77 55.63,76.71 60.71,76.71 60.71,78.49 56.9,82.3 56.9,82.04
  pour Bottom: 105.92,57.15 105.92,53.85 96.01,53.85 96.01,59.94 99.06,59.94 101.85,57.15
  pour Top: 105.92,57.15 105.92,53.85 96.01,53.85 96.01,59.94 99.06,59.94 101.85,57.15
N$68
  Top 0.254: U$2.1 72.58,66.62 72.01,67.18 C28.1
N$69
  Top 1.27: R43.1 49.02,78.74 Q5.G
N$70
  Top 0.254: U$2.23 80.01,65.91 81.03,66.93 81.03,68.58 80.77,69.34 75.18,69.34 73.91,70.61 R44.2
N$71
  Top 1.27: R44.1 74.17,79.5 Q7.G
N$72  (via drill 1.6)  (2 unrouted)
  Top 2.184: Q8.D v88.14,77.72
  other vias: 104.39,69.6 101.09,69.6 79.5,77.72
  pour Top (no thermals): 78.49,81.79 80.52,81.79 83.82,78.49 83.82,76.71 78.99,76.71 78.49,77.22
  pour Top: 105.92,71.37 99.31,71.37 99.31,64.01 105.92,64.01
  pour Bottom: 105.92,64.01 99.31,64.01 99.31,71.37 105.92,71.37
N$73
  Top 0.254: C33.1 80.26,67.7 80.26,67.06 79.78,66.57 U$2.24
N$74
  Top 1.27: R45.1 Q8.G
N$75
  Top 1.27: R46.1 Q6.G
N$76
  Top 0.254: R46.2 62.74,69.34 66.55,65.02 69.09,65.02 69.45,64.67 U$2.4
N$77
  Top 0.254: U$2.21 80.37,64.62 81.03,65.28 84.84,65.28 86.36,66.8 86.36,69.85 R45.2
N$78  (via drill 0.6)
  Top 0.254: U$2.20 79.09,64.01 81.28,64.01 R48.1 81.7,63.21 81.92,62.99 v82.17,62.99 | v89.41,64.52 88.14,65.79 v88.14,70.36
  Bottom 0.254: Q6.S 69.09,80.77 | 91.69,80.77 90.68,80.77 Q8.S | 91.69,74.17 88.89,74.17 R47.1 88.39,70.61 v88.14,70.36 | v82.17,62.99 84.33,65.15 88.65,65.15 89.28,64.52 v89.41,64.52
  Bottom 3.81: 69.09,80.77 69.09,74.17 91.69,74.17 91.69,80.77
N$79
  Top 0.254: U$1.22 32,65.02 32.26,64.77 32.51,64.77 32.78,64.91 C23.2 33.92,64.91 37.85,68.83 R57.2
N$80
  Top 0.254: JMP9.1 50.62,51.23 PCB1.5
N$81
  Top 0.254: JMP9.3 54.02,50.72 PCB1.4
N$82
  Top 0.254: JMP10.1 56.21,50.72 PCB1.3
N$83
  Top 0.254: JMP10.3 59.61,51.23 PCB1.2
REF_3P3V  (via drill 0.6)
  Top 0.254: U3.5 U3.6 19.88,45.56 R8.1 20.73,45.63 R10.2 22.61,43.62 22.61,42.16 24.89,39.88 24.89,37.08 24.13,36.32 24.13,34.29 42.93,15.49 v46.74,15.49 | R16.2 56.54,18.96 C4.1 50.71,18.96 50.29,18.54 50.29,16.51 v51.31,15.49 | v64.77,12.45 68.58,16.26 R17.2 70.93,17.34 71.12,17.53 71.88,17.53 72.14,17.78 72.14,18.45 C15.1 71.12,18.54 70.61,18.03 R2.2 R1.2
  Bottom 0.254: v46.74,15.49 v51.31,15.49 52.07,14.73 63.75,14.73 64.77,13.72 v64.77,12.45

### Text on the board
Document: Max current: / TEC: HP-127120 / 12A @ 14.5V / 106W Heat/174W Electrical / => 2x12A = 24A